# EAGLE design Access ID V2.0 (EAGLE 8.3.0)
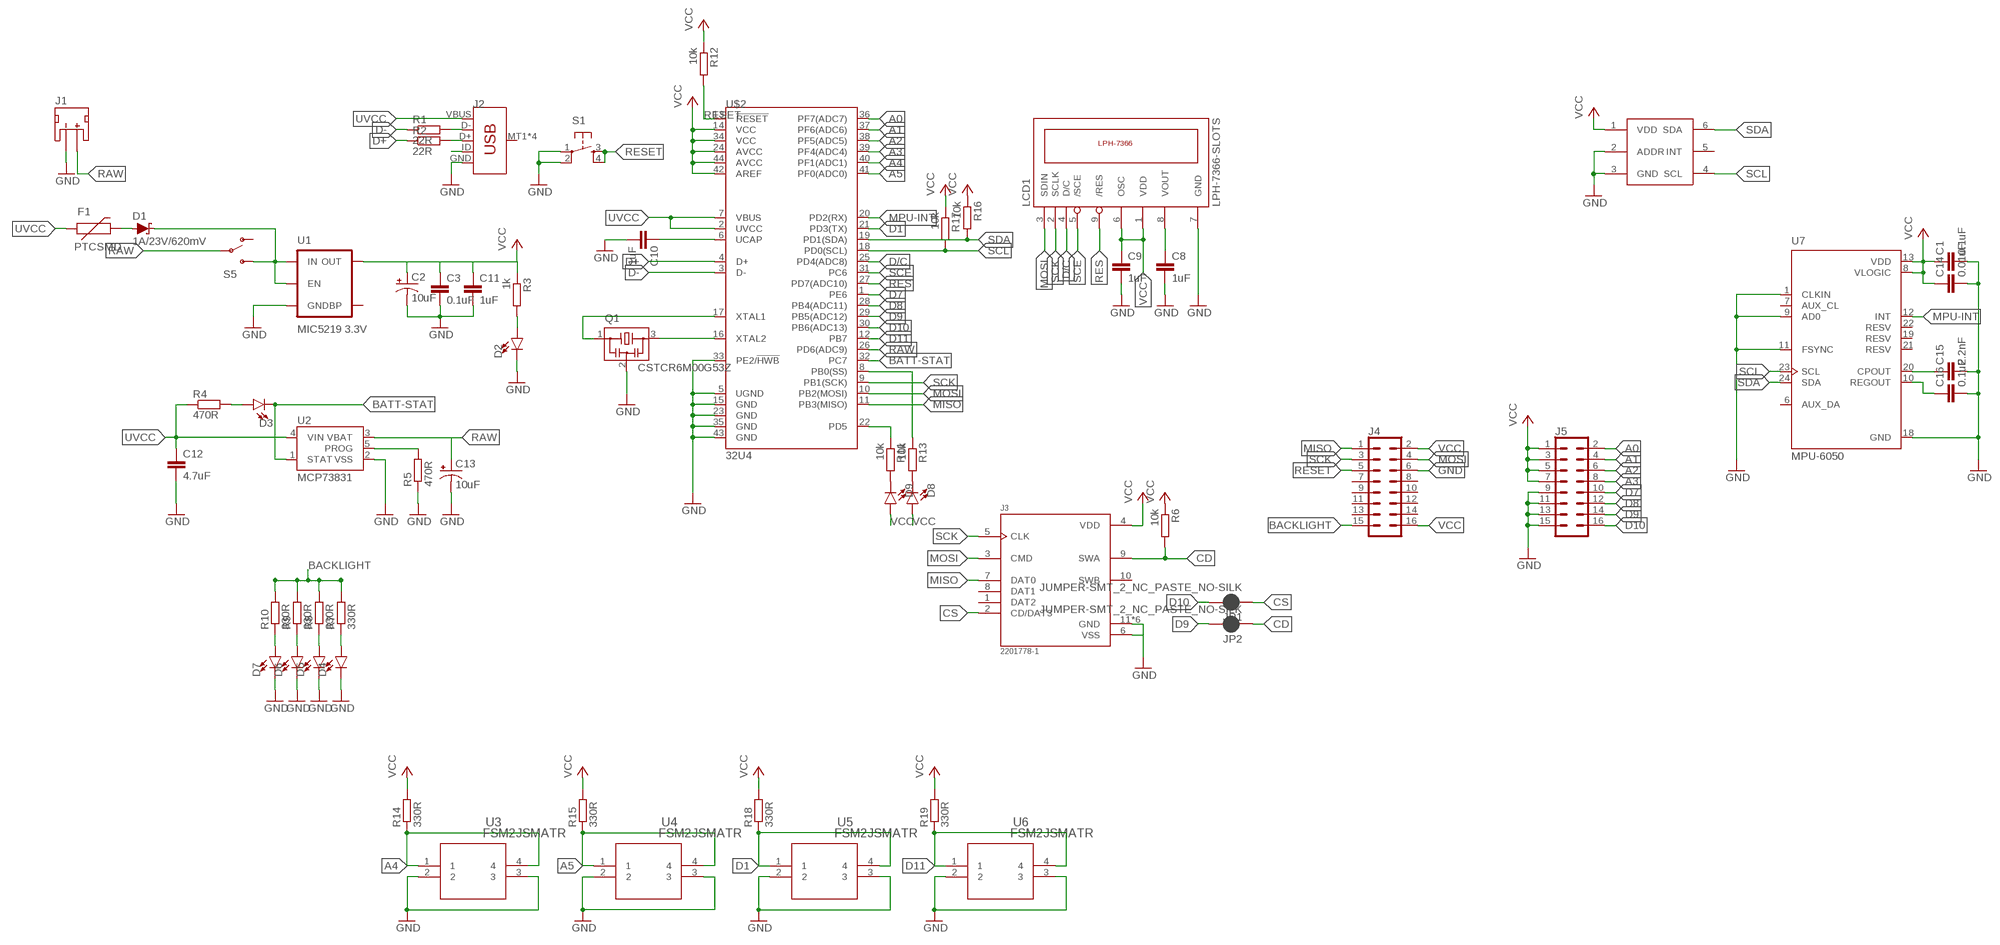
[diagram p0: schematic, sheet 1]

## Parts
C1  0.1uF  C-EUC0603K  [C0603K]
C2  10uF  10UF-POLAR-EIA3216-16V-10%(TANT)  [EIA3216]
C3  0.1uF  C-EUC0603K  [C0603K]
C8  1uF  C-EUC0603K  [C0603K]
C9  1uF  C-EUC0603K  [C0603K]
C10  1uF  C-EUC0603K  [C0603K]
C11  1uF  C-EUC0603K  [C0603K]
C12  4.7uF  C-EUC0603K  [C0603K]
C13  10uF  10UF-POLAR-EIA3216-16V-10%(TANT)  [EIA3216]
C14  0.01uF  C-EUC0603K  [C0603K]
C15  2.2nF  C-EUC0603K  [C0603K]
C16  0.1uF  C-EUC0603K  [C0603K]
D1  1A/23V/620mV  DIODE-SCHOTTKY-BAT20J  [SOD-323]
D2  LED0603  [LED-0603]
D3  LED0603  [LED-0603]
D4  LED0603  [LED-0603]
D5  LED0603  [LED-0603]
D6  LED0603  [LED-0603]
D7  LED0603  [LED-0603]
D8  LED0603  [LED-0603]
D9  LED0603  [LED-0603]
F1  PTCSMD  [PTC-1206]
J1  JST_2MM_MALE  [JST-2-SMD]
J2  USB_MICRO-B_SMT  [USB-MICROB]
J3  2201778-1  [TE_2201778-1]
J4  CONN_08X2  [2X8]
J5  CONN_08X2  [2X8]
JP1  JUMPER-SMT_2_NC_PASTE_NO-SILK  [SMT-JUMPER_2_NC_PASTE_NO-SILK]
JP2  JUMPER-SMT_2_NC_PASTE_NO-SILK  [SMT-JUMPER_2_NC_PASTE_NO-SILK]
LCD1  LPH-7366-SLOTS  [LPH-7366-SLOTS]
Q1  CSTCR6M00G53Z  [CSTCR6M]
R1  22R  R-EU_R0603  [R0603]
R2  22R  R-EU_R0603  [R0603]
R3  1k  R-EU_R0603  [R0603]
R4  470R  R-EU_R0603  [R0603]
R5  470R  R-EU_R0603  [R0603]
R6  10k  R-EU_R0603  [R0603]
R7  330R  R-EU_R0603  [R0603]
R8  330R  R-EU_R0603  [R0603]
R9  330R  R-EU_R0603  [R0603]
R10  330R  R-EU_R0603  [R0603]
R11  10k  R-EU_R0603  [R0603]
R12  10k  R-EU_R0603  [R0603]
R13  10k  R-EU_R0603  [R0603]
R14  330R  R-EU_R0603  [R0603]
R15  330R  R-EU_R0603  [R0603]
R16  10k  R-EU_R0603  [R0603]
R17  10k  R-EU_R0603  [R0603]
R18  330R  R-EU_R0603  [R0603]
R19  330R  R-EU_R0603  [R0603]
S1  TAC_SWITCHSMD  [TACTILE_SWITCH_SMD]
S5  SWITCH-SPDT-SMD-A  [SWITCH-SPST-SMD-A]
U1  MIC5219 3.3V  V_REG_MIC52193.3V  [SOT23-5]
U2  MCP73831  [SOT23-5]
U3  FSM2JSMATR  [SWITCH_FSM2JSMAA]
U4  FSM2JSMATR  [SWITCH_FSM2JSMAA]
U5  FSM2JSMATR  [SWITCH_FSM2JSMAA]
U6  FSM2JSMATR  [SWITCH_FSM2JSMAA]
U7  MPU-6050  [QFN50P400X400X95-24N]
U$2  32U4  ATMEGA32U4QFN2  [QFN-44-NOPAD]
U$3  TI-OPT3001  [TI-OPT3001]

## Nets
A0: J5.2 U$2.36(PF7(ADC7))
A1: J5.4 U$2.37(PF6(ADC6))
A2: J5.6 U$2.38(PF5(ADC5))
A3: J5.8 U$2.39(PF4(ADC4))
A4: R14.1 U3.1 U3.4 U$2.40(PF1(ADC1))
A5: R15.1 U4.1 U4.4 U$2.41(PF0(ADC0))
BACKLIGHT: J4.15 R7.2 R8.2 R9.2 R10.2
BATT-STAT: D3.C U2.1(STAT) U$2.32(PC7)
CD: J3.9(SWA) JP2.1 R6.2
CS: J3.2(CD/DAT3) JP1.1
D1: R18.1 U5.1 U5.4 U$2.21(PD3(TX))
D7: J5.10 U$2.1(PE6)
D8: J5.12 U$2.28(PB4(ADC11))
D9: J5.14 JP2.2 U$2.29(PB5(ADC12))
D10: J5.16 JP1.2 U$2.30(PB6(ADC13))
D11: R19.1 U6.1 U6.4 U$2.12(PB7)
D+: R2.1 U$2.4(D+)
D-: R1.1 U$2.3(D-)
D/C: LCD1.4(D/C) U$2.25(PD4(ADC8))
GND: C1.2 C2.- C3.2 C8.2 C9.2 C10.2 C11.2 C12.2 C13.- C14.2 C15.2 C16.2 D2.C D4.C D5.C D6.C D7.C J1.1(-) J2.GND J3.6(VSS) J3.11(GND) J3.12(GND) J3.13(GND) J3.14(GND) J3.15(GND) J3.16(GND) J4.6 J5.9 J5.11 J5.13 J5.15 LCD1.7(GND) Q1.2 R5.1 S1.1 S1.2 U1.2(GND) U2.2(VSS) U3.2 U3.3 U4.2 U4.3 U5.2 U5.3 U6.2 U6.3 U7.1(CLKIN) U7.9(AD0) U7.11(FSYNC) U7.18(GND) U$2.5(UGND) U$2.15(GND) U$2.23(GND) U$2.33(PE2/!HWB) U$2.35(GND) U$2.43(GND) U$3.2(ADDR) U$3.3(GND)
MISO: J3.7(DAT0) J4.1 U$2.11(PB3(MISO))
MOSI: J3.3(CMD) J4.4 LCD1.3(SDIN) U$2.10(PB2(MOSI))
MPU-INT: U7.12(INT) U$2.20(PD2(RX))
N$1: C15.1 U7.20(CPOUT)
N$2: D3.A R4.2
N$3: C10.1 U$2.6(UCAP)
N$5: J2.D+ R2.2
N$6: J2.ID
N$7: R5.2 U2.5(PROG)
N$8: D7.A R10.1
N$9: J2.D- R1.2
N$10: D6.A R9.1
N$11: C16.1 U7.10(REGOUT)
N$12: D1.C S5.3(S) U1.1(IN) U1.3(EN)
N$15: D2.A R3.2
N$16: D5.A R8.1
N$17: C8.1 LCD1.8(VOUT)
N$18: D4.A R7.1
N$19: Q1.1 U$2.17(XTAL1)
N$20: D1.A F1.2
N$21: Q1.3 U$2.16(XTAL2)
N$22: R13.1 U$2.8(PB0(SS))
N$23: D9.C R11.2
N$25: R11.1 U$2.22(PD5)
N$26: D8.C R13.2
RAW: C13.+ J1.2(+) S5.2(P) U2.3(VBAT) U$2.26(PD6(ADC9))
RES: LCD1.9(/RES) U$2.27(PD7(ADC10))
RESET: J4.5 R12.2 S1.3 S1.4 U$2.13(!RESET)
SCE: LCD1.5(/SCE) U$2.31(PC6)
SCK: J3.5(CLK) J4.3 LCD1.2(SCLK) U$2.9(PB1(SCK))
SCL: R17.2 U7.23(SCL) U$2.18(PD0(SCL)) U$3.4(SCL)
SDA: R16.2 U7.24(SDA) U$2.19(PD1(SDA)) U$3.6(SDA)
UVCC: C12.1 F1.1 J2.VBUS R4.1 U2.4(VIN) U$2.2(UVCC) U$2.7(VBUS)
VCC: C1.1 C2.+ C3.1 C9.1 C11.1 C14.1 D8.A D9.A J3.4(VDD) J4.2 J4.16 J5.1 J5.3 J5.5 J5.7 LCD1.1(VDD) LCD1.6(OSC) R3.1 R6.1 R12.1 R14.2 R15.2 R16.1 R17.1 R18.2 R19.2 U1.5(OUT) U7.8(VLOGIC) U7.13(VDD) U$2.14(VCC) U$2.24(AVCC) U$2.34(VCC) U$2.42(AREF) U$2.44(AVCC) U$3.1(VDD)
Unconnected: J1.NC1(PAD1) J1.NC2(PAD2) J2.MT1(SHIELD) J2.MT2(SHIELD) J2.P$1(SHIELD) J2.P$2(SHIELD) J3.1(DAT2) J3.8(DAT1) J3.10(SWB) J4.7 J4.8 J4.9 J4.10 J4.11 J4.12 J4.13 J4.14 S5.1(O) U1.4(BP) U7.6(AUX_DA) U7.7(AUX_CL) U7.19(RESV) U7.21(RESV) U7.22(RESV) U$3.5(INT)

## Library data of the parts
C1 C3 C8-C12 C14-C16 = resistor:C-EU: CAPACITOR, European symbol
C2 C13 = SparkFun-Capacitors:10UF-POLAR: 10.0µF polarized capacitors A capacitor is a passive two-terminal electrical component used to store electrical energy temporarily in an electric field.; PROD_ID: CAP-00811
D1 = SparkFun-DiscreteSemi:DIODE-SCHOTTKY: Schottky diode A Schottky diode is a semiconductor diode which has a low forward voltage drop and a very fast switching action.; PROD_ID: DIO-11623
D2-D9 = SparkFun-LED:LED: LED (Generic) Standard schematic elements and footprints for 5mm, 3mm, 1206, and 0603 sized LEDs. Generic LEDs with no color specified.
F1 = SparkFun-PowerIC:PTC: Resettable Fuse PTC Resettable Fuse. Spark Fun Electronics SKU : COM-08357; PROD_ID: RES-11150
J1 = SparkFun-Connectors:JST_2MM_MALE: Mates to single-cell LiPo batteries. CONN-11443 Now with smashable polarity marks!; BTM_NEG: -; BTM_POS: +; PROD_ID: CONN-11443; TOP_NEG: -; TOP_POS: +
J2 = SparkFun-Connectors:USB_MICRO-B: USB Type Micro-B Connector Male/female and PTH/SMT variants SparkFun Products: SparkFun microB USB Breakout <https://www.sparkfun.com/products/12035> SparkFun USB microB Plug Breakout <https://www.sparkfun.com/products/10031> SparkFun ESP8266 Thing <https://www.sparkfun.com/products/13231>; PROD_ID: CONN-09505; SF_ID: PRT-08533
J3 = 2201778-1:2201778-1: MICRO SD PUSH PUSH LOW PROFILE TYPE; MANUFACTURER: TE Connectivity; PARTREV: B; STANDARD: Manufacturer recommendations
J4 J5 = SparkFun-Connectors:CONN_08X2: Multi connection point. Often used as Generic Header-pin footprint for 0.1 inch spaced/style header connections You can populate with any combo of single row headers, but if you'd like an exact match, check this: Header - 2x8 (Male, 0.1") <https://www.sparkfun.com/products/13156> (PRT-13156) On any of the 0.1 inch spaced packages, you can populate with these: Break Away Headers - Straight <https://www.sparkfun.com/products/116> (PRT-00116) Break Away Male Headers - Right Angle <https://www.sparkfun.com/products/553> (PRT-00553) Female Headers <https://www.sparkfun.com/products/115> (PRT-00115) Break Away Headers - Machine Pin <https://www.sparkfun.com/products/117> (PRT-00117) Break Away Female Headers - Swiss Machine Pin <https://www.sparkfun.com/products/743> (PRT-00743)
JP1 JP2 = SparkFun-Jumpers:JUMPER-SMT_2_NC_PASTE: Normally closed solder jumper This jumper has an aperture in the stencil to allow solder paste to bridge the split in the wire so it's normally closed (NC). Wick off the solder to open the connection. Reapply solder to reclose the connection.
LCD1 = lph-7366 copy:LPH-7366-SLOTS
Q1 = murata-filter:CSTCR: Resonator Source: murata.co.jp; MPN: CSTCR6M00G53-R0; OC_FARNELL: 1170434; OC_NEWARK: 25M8759
R1-R19 = resistor:R-EU_: RESISTOR, European symbol
S1 = adjacent-reality:TAC_SWITCH: Momentary Switch Button commonly used for reset or general input. Spark Fun Electronics SKU : COM-00097
S5 = SparkFun-Electromechanical:SWITCH-SPDT: SPDT Switch Simple slide switch, Spark Fun Electronics SKU : COM-00102 DPDT SMT slide switch, AYZ0202, SWCH-08179; PROD_ID: SWCH-10651
U1 = SparkFun-PowerIC:V_REG_MIC5219: V_REG MIC5219 Standard 3.3V and 5V 500mA LDO voltage regulator in SOT-23 layout. Micrel part MIC5219. BP (by-pass) pin is used to lower output noise with 470pF cap, may be left open.; PROD_ID: VREG-09872
U2 = SparkFun-PowerIC:MCP73831: Miniature single cell, fully integrated Li-Ion, Li-polymer charge management controller http://ww1.microchip.com/downloads/en/DeviceDoc/20001984g.pdf IC-09995; PROD_ID: IC-09995
U3-U6 = Beeclust:FSM2JSMATR; MANUFACTURER_PART_NUMBER: FSM2JSMATR; VENDOR: TE Connectivity
U7 = MPU-6050:MPU-6050: MPU-6050 Six-Axis (Gyro + Accelerometer) MEMS MotionTracking™ Devices; AVAILABILITY: Good; DESCRIPTION: 3-axis gyroscope, 3-axis accelerometer in a 4x4x0.9 housing; MF: TDK; MP: MPU-6050; PACKAGE: QFN-24 InvenSense; PRICE: 5.41 USD
U$2 = SparkFun-IC-Microcontroller:ATMEGA32U4: Atmel MCU, 32KByte Atmel 44-pin 8-bit Microcontroller with 32KBytes of ISP Flash and USB Controller Datasheet <http://cdn.sparkfun.com/datasheets/Dev/Arduino/Boards/ATMega32U4.pdf> SparkFun Products LilyPad Arduino USB - ATmega32U4 Board <https://www.sparkfun.com/products/12049> (DEV-12049) Pro Micro - 5V/16MHz <https://www.sparkfun.com/products/12640> (DEV-12640) Pro Micro - 3.3V/8MHz <https://www.sparkfun.com/products/12587> (DEV-12587) Fio v3 - ATmega32U4 <https://www.sparkfun.com/products/11520> (DEV-11520) Qduino Mini <https://www.sparkfun.com/products/13614> (DEV-13614) Makey Makey - Standard Kit <https://www.sparkfun.com/products/11511> (WIG-11511) Makey Makey Deluxe Kit <https://www.sparkfun.com/products/11519> (WIG-11519); PROD_ID: IC-10828
U$3 = FaBo-Mems:TI-OPT3001

## Board
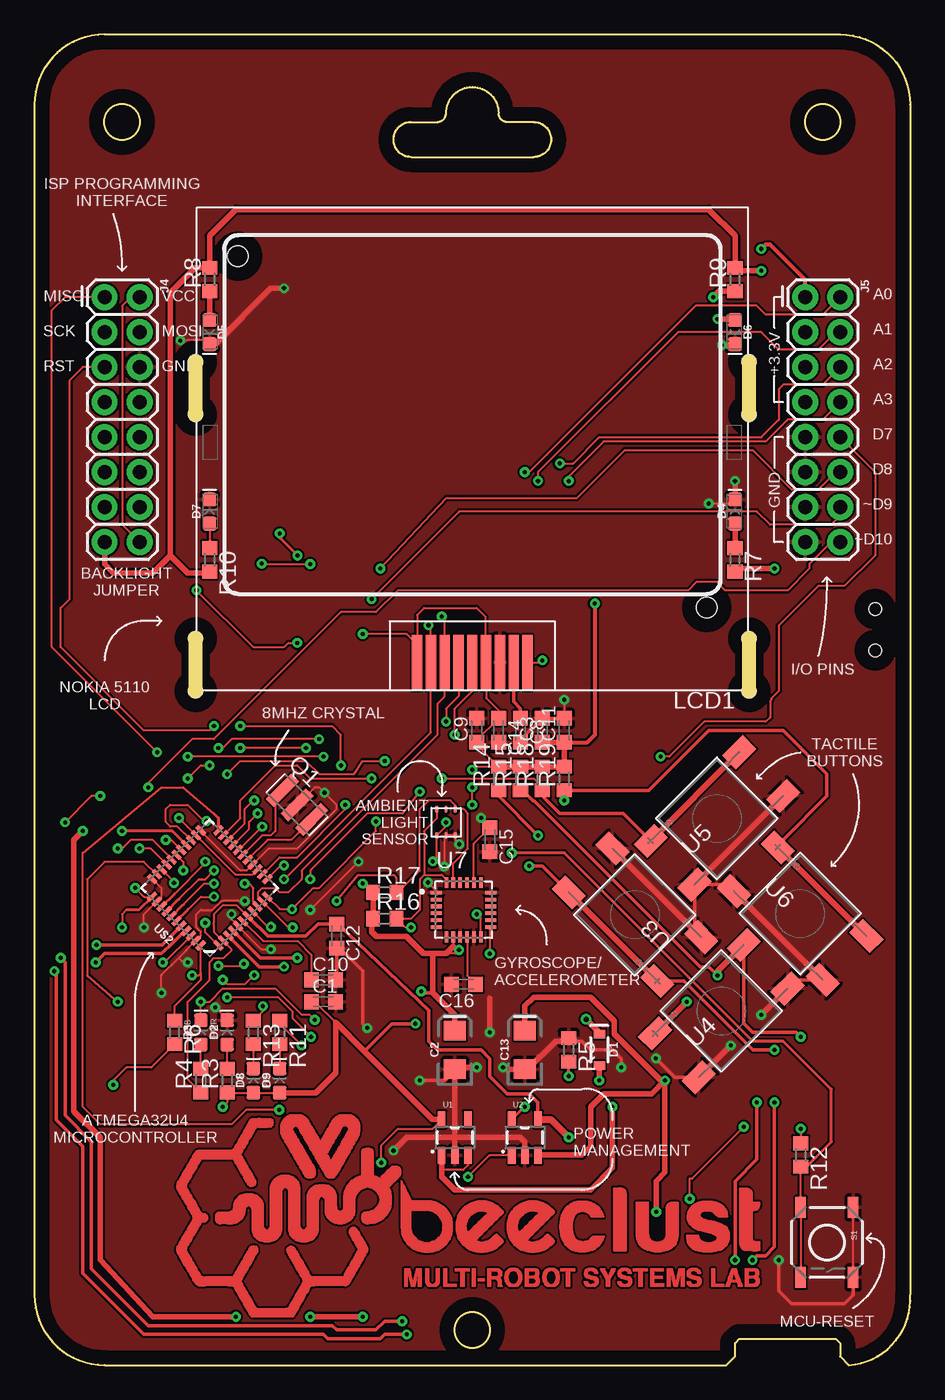
[diagram p1: board, top side]
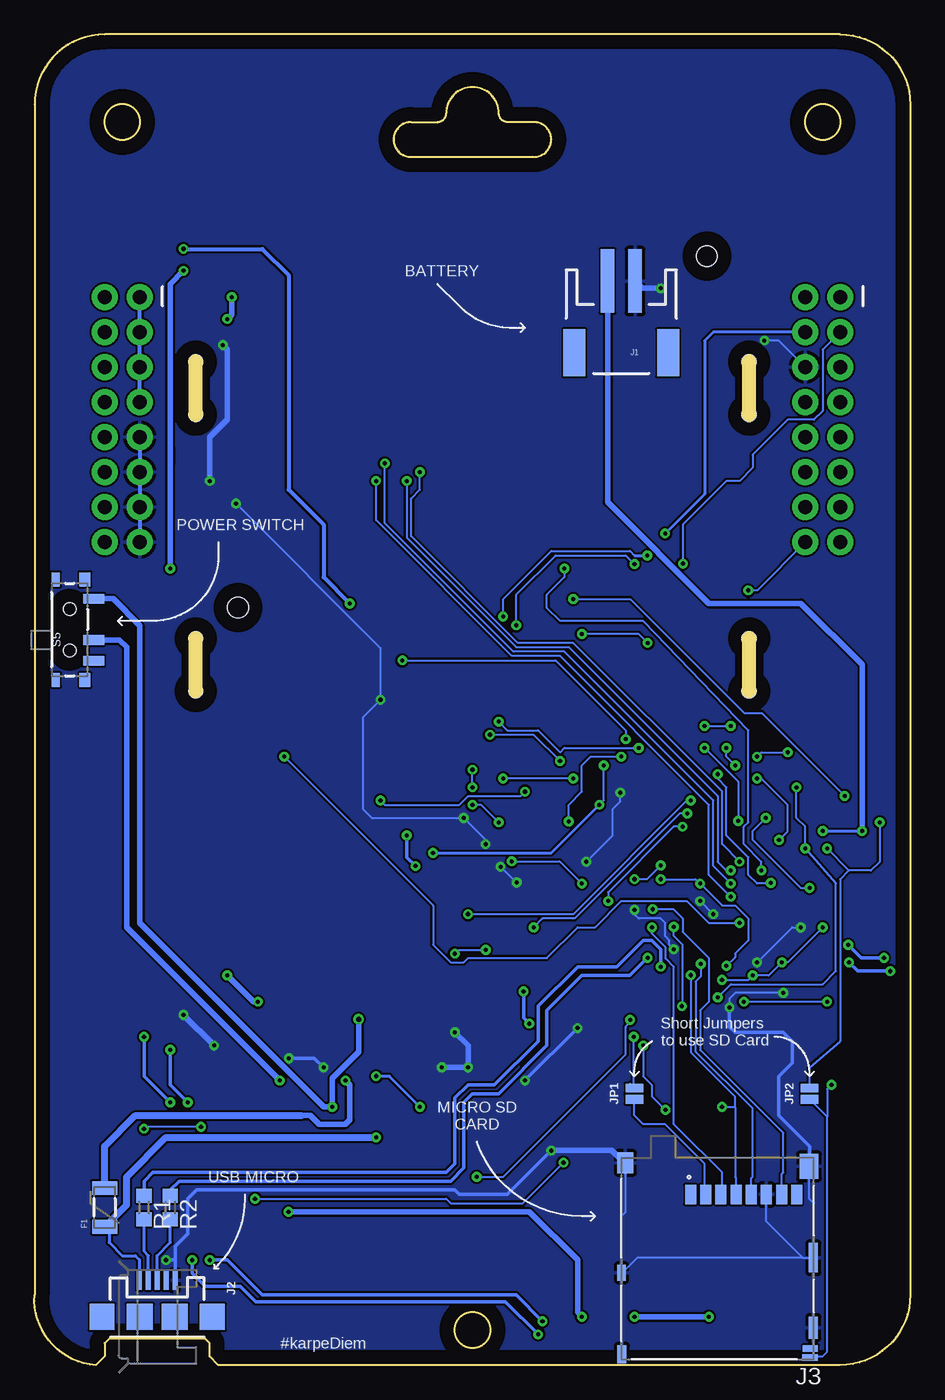
[diagram p2: board, bottom side, seen from below]

Size 63.51 x 96.52 mm. Coordinates in mm from the lower left corner, seen from the top.
Outline: 5.08,96.52 58.42,96.52 arc-90 63.5,91.44 63.5,5.08 arc-90 59.05,0 58.42,0.63 58.42,1.59 58.1,1.91 51.12,1.91 50.8,1.59 50.8,0.63 50.16,0 5.08,0 arc-90 0,5.08 0,91.44 arc-90 5.08,96.52
Outline: 26.04,88.9 arc-90 27.3,90.17 29.21,90.17 arc90 29.84,90.8 arc-180 33.66,90.8 arc90 34.29,90.17 36.2,90.17 arc-90 37.47,88.9 arc-90 36.2,87.63 27.3,87.63 arc-90 26.04,88.9
Outline: circle at 6.35,90.17 radius 1.27
Outline: circle at 57.15,90.17 radius 1.27
Outline: circle at 31.75,2.54 radius 1.27
Copper layers (1*16): Top 0.035mm / dielectric 1.5mm / Bottom 0.035mm
Design rules "default *": minimum track width 6mil, minimum drill 0.35mm, track to track 6mil, track to pad 6mil, pad to pad 6mil, via to via 6mil, smd to smd 6mil, copper to edge 40mil, drill to drill 6mil, minimum pad ring 10mil, minimum via ring 8mil, stop-mask expansion 4mil, vias tented up to drill 12mil, thermal gap 10mil

### Footprints (pad centres in the part's own frame; a part is rotated, then mirrored left to right if it is on the bottom)
C0603K = smd 1.05 x 1.08: 1 -0.875,0; 2 0.875,0
EIA3216 = smd 1.4 x 1.6: + 1.4,0; - -1.4,0
SOD-323 = smd 0.63 x 0.83: A 1.15,0; C -1.15,0
LED-0603 = smd 1 x 1: A -0.877,0; C 0.877,0
PTC-1206 = smd 1 x 1.8: 1 -1.4,0; 2 1.4,0
JST-2-SMD = smd 1 x 4.6: 1 -1,-3.7; 2 1,-3.7 | smd 1.6 x 3.4: NC1 -3.4,1.5; NC2 3.4,1.5
USB-MICROB = smd 1.4 x 0.35: D+ -2.65,0; D- -2.65,-0.65; GND -2.65,1.3; ID -2.65,0.65; VBUS -2.65,-1.3 | smd 1.9 x 1.8: MT1 0,-4; MT2 0,4 | smd 1.9 x 1.9: P$1 0,-1.27; P$2 0,1.27
TE_2201778-1 = smd 0.8 x 1.4: 1 1.965,-4.75; 2 0.865,-4.75; 3 -0.235,-4.75; 4 -1.335,-4.75; 5 -2.435,-4.75; 6 -3.535,-4.75; 7 -4.635,-4.75; 8 -5.735,-4.75 | smd 1.15 x 0.45: 9 -6.7,7.075 | smd 1.1 x 0.45: 10 -6.725,6.415 | smd 1.35 x 1.8: 11 -6.625,-6.8 | smd 0.65 x 2.14: 12 -6.95,-0.17 | smd 0.65 x 1.6: 13 -6.95,4.91 | smd 0.65 x 1.3: 14 6.95,6.85 | smd 0.6 x 1.15: 15 6.975,0.925 | smd 1.16 x 1.5: 16 6.695,-7.05
2X8 = drill 1.016 pad 1.88: 1 0,0; 2 0,2.54; 3 2.54,0; 4 2.54,2.54; 5 5.08,0; 6 5.08,2.54; 7 7.62,0; 8 7.62,2.54; 9 10.16,0; 10 10.16,2.54; 11 12.7,0; 12 12.7,2.54; 13 15.24,0; 14 15.24,2.54; 15 17.78,0; 16 17.78,2.54
SMT-JUMPER_2_NC_PASTE_NO-SILK = smd 0.635 x 1.27: 1 -0.406,0; 2 0.406,0
LPH-7366-SLOTS = smd 0.75 x 4: 1 4,17; 2 3,17; 3 2,17; 4 1,17; 5 0,17; 6 -1,17; 7 -2,17; 8 -3,17; 9 -4,17 | hole 1.5: -17,13; 17,-12.5 | hole 1.016: -20.066,19.05; -20.066,15.24; 20.066,19.05; 20.066,15.24; 20.066,-1.016; 20.066,-4.826; -20.066,-1.016; -20.066,-4.826
CSTCR6M = smd 0.8 x 2.6: 1 -1.5,0; 2 0,0; 3 1.5,0
R0603 = smd 1 x 1.1: 1 -0.85,0; 2 0.85,0
TACTILE_SWITCH_SMD = smd 1.524 x 0.762: 1 -2.54,1.905; 2 2.54,1.905; 3 -2.54,-1.905; 4 2.54,-1.905
SWITCH-SPST-SMD-A = smd 0.7 x 1.5: 1 -2.25,-1.75; 2 -0.75,-1.75; 3 2.25,-1.75 | smd 1 x 0.6: GND1 -3.65,1; GND3 3.65,1 | smd 1 x 0.8: GND2 -3.65,-1.1; GND4 3.65,-1.1 | hole 0.9: -1.5,0; 1.5,0
SOT23-5 = smd 0.55 x 1.2: 1 -0.95,-1.3; 2 0,-1.3; 3 0.95,-1.3; 4 0.95,1.3; 5 -0.95,1.3
SWITCH_FSM2JSMAA = smd 2.108 x 1.397: 1 -9.093,4.496; 2 -9.093,0; 3 0,0; 4 0,4.496
QFN50P400X400X95-24N = smd 0.79 x 0.26: 1 -1.97,1.25; 2 -1.97,0.75; 3 -1.97,0.25; 4 -1.97,-0.25; 5 -1.97,-0.75; 6 -1.97,-1.25; 13 1.97,-1.25; 14 1.97,-0.75; 15 1.97,-0.25; 16 1.97,0.25; 17 1.97,0.75; 18 1.97,1.25 | smd 0.26 x 0.79: 7 -1.25,-1.97; 8 -0.75,-1.97; 9 -0.25,-1.97; 10 0.25,-1.97; 11 0.75,-1.97; 12 1.25,-1.97; 19 1.25,1.97; 20 0.75,1.97; 21 0.25,1.97; 22 -0.25,1.97; 23 -0.75,1.97; 24 -1.25,1.97
QFN-44-NOPAD = smd 0.8 x 0.3: 1 -3.4,2.5; 2 -3.4,2; 3 -3.4,1.5; 4 -3.4,1; 5 -3.4,0.5; 6 -3.4,0; 7 -3.4,-0.5; 8 -3.4,-1; 9 -3.4,-1.5; 10 -3.4,-2; 11 -3.4,-2.5; 23 3.4,-2.5; 24 3.4,-2; 25 3.4,-1.5; 26 3.4,-1; 27 3.4,-0.5; 28 3.4,0; 29 3.4,0.5; 30 3.4,1; 31 3.4,1.5; 32 3.4,2; 33 3.4,2.5 | smd 0.3 x 0.8: 12 -2.5,-3.4; 13 -2,-3.4; 14 -1.5,-3.4; 15 -1,-3.4; 16 -0.5,-3.4; 17 0,-3.4; 18 0.5,-3.4; 19 1,-3.4; 20 1.5,-3.4; 21 2,-3.4; 22 2.5,-3.4; 34 2.5,3.4; 35 2,3.4; 36 1.5,3.4; 37 1,3.4; 38 0.5,3.4; 39 0,3.4; 40 -0.5,3.4; 41 -1,3.4; 42 -1.5,3.4; 43 -2,3.4; 44 -2.5,3.4
TI-OPT3001 = smd 0.5 x 0.25: 1 -0.95,0.675; 2 -0.95,0; 3 -0.95,-0.675; 4 0.95,-0.675; 5 0.95,0; 6 0.95,0.675

### Placement (x,y rotation side)
C1  20.95,26.35 0 top
C2  30.48,22.86 90 top
C3  36.83,46.04 90 top
C8  35.24,46.04 270 top
C9  32.07,46.04 90 top
C10  20.95,27.94 0 top
C11  38.42,46.04 90 top
C12  21.91,31.12 270 top
C13  35.56,22.86 90 top
C14  33.66,46.04 270 top
C15  33.02,38.1 270 top
C16  31.11,27.62 180 top
D1  40.96,22.86 270 top
D2  13.97,24.13 90 top
D3  12.06,24.13 90 top
D4  50.8,61.91 90 top
D5  12.7,74.93 270 top
D6  50.8,74.93 270 top
D7  12.7,61.91 90 top
D8  15.88,20.64 90 top
D9  17.78,20.64 90 top
F1  58.42,11.43 90 bottom
J1  20.95,74.93 180 bottom
J2  54.61,3.49 270 bottom
J3  13.97,7.62 180 bottom
J4  5.08,77.47 270 top
J5  55.88,77.47 270 top
JP1  20,19.69 90 bottom
JP2  7.3,19.69 90 bottom
LCD1  31.75,67.94 180 top
Q1  19.05,40.64 315 top
R1  55.56,11.43 270 bottom
R2  53.66,11.43 270 bottom
R3  13.97,20.64 90 top
R4  12.06,20.64 90 top
R5  38.73,22.86 270 top
R6  10.16,24.13 270 top
R7  50.8,58.42 270 top
R8  12.7,78.74 90 top
R9  50.8,78.74 90 top
R10  12.7,58.42 270 top
R11  17.78,24.13 270 top
R12  55.56,15.24 270 top
R13  15.88,24.13 270 top
R14  33.66,42.55 90 top
R15  35.24,42.55 90 top
R16  25.4,32.38 0 top
R17  25.4,34.29 0 top
R18  36.83,42.55 90 top
R19  38.42,42.55 90 top
S1  57.47,8.89 270 top
S5  60.96,53.34 90 bottom
U1  30.48,16.51 0 top
U2  35.56,16.51 0 top
U3  41.91,37.47 135 top
U4  54.61,27.3 45 top
U5  54.29,41.27 45 top
U6  57.15,27.94 315 top
U7  31.11,33.02 0 top
U$2  12.7,34.61 135 top
U$3  29.84,39.37 90 top

### Tracks (layer width: path | path; a pad name or v marks a point on that pad's centre or on a via)
A0  (via drill 0.3)
  Top 0.152: J5.2 57.15,76.2 53.02,76.2 52.39,76.83 47.94,76.83 37.24,66.14 | 37.24,66.14 37.15,66.04 | 10.16,34.19 12.38,36.41 v12.38,36.51 | v35.56,64.77 35.88,64.77 37.24,66.14
  Top 0.203: U$2.36 10.16,34.19
  Bottom 0.152: v12.38,36.51 13.65,37.78 13.65,41.59 24.45,52.39 28.46,52.39 36.2,60.12 36.2,62.87 35.56,63.5 v35.56,64.77
A1  (via drill 0.3)
  Top 0.152: J5.4 58.1,74.93 56.83,73.66 53.98,73.66 52.7,74.93 46.67,74.93 36.51,64.77 v36.51,64.13 | v13.02,35.88 12.38,35.24 12.16,35.24 | 12.16,35.24 12.06,35.24 | 10.48,33.8 11.92,35.24 12.16,35.24
  Top 0.203: U$2.37 10.48,33.8
  Bottom 0.152: v36.51,64.13 36.51,60.01 28.57,52.07 24.77,52.07 13.97,41.27 13.97,36.51 13.34,35.88 v13.02,35.88
A2  (via drill 0.3)
  Top 0.152: J5.6 57.15,71.12 54.29,71.12 53.98,70.8 53.98,68.58 52.7,67.31 40.96,67.31 39.05,65.4 v38.1,65.4 | 10.79,33.41 12.31,34.93 v13.02,34.93
  Top 0.203: U$2.38 10.79,33.41
  Bottom 0.152: v13.02,34.93 14.29,36.2 14.29,40.96 25.08,51.75 28.78,51.75 38.1,61.07 v38.1,65.4
A3  (via drill 0.3)
  Top 0.152: J5.8 57.15,68.58 54.61,68.58 53.02,66.99 41.27,66.99 38.73,64.45 v38.73,64.13 | 11.15,33.06 12.06,33.97 v13.02,33.97
  Top 0.203: U$2.39 11.15,33.06
  Bottom 0.152: v13.02,33.97 14.61,35.56 14.61,40.64 25.4,51.44 28.89,51.44 38.73,61.28 v38.73,64.13
A4  (via drill 0.3)
  Top 0.254: R14.1 33.66,41.27 v36.51,38.42 | v35.88,36.2 36.82,36.2 U3.4 | U3.1 47.07,27.86 52.07,22.86 v53.66,22.86 | v52.39,19.05 52.39,14.92 50.8,13.34 v50.8,7.62 | v26.67,3.17 25.4,3.17 24.77,2.54 21.91,2.54 21.59,2.86 8.26,2.86 4.13,6.99 4.13,16.19 2.22,18.1 2.22,29.21 v1.91,29.53 | v4.5,30.48 9.28,30.48 U$2.40
  Top 0.406: U3.4 U3.1
  Bottom 0.254: v36.51,38.42 36.51,36.83 v35.88,36.2 | v53.66,22.86 53.66,20.32 v52.39,19.05 | v50.8,7.62 49.53,7.62 46.99,5.08 28.57,5.08 v26.67,3.17 | v1.91,29.53 3.55,29.53 v4.5,30.48
A5  (via drill 0.3)
  Top 0.254: R15.1 35.38,41.7 36.16,40.92 36.24,40.92 48.26,28.89 48.9,28.89 v49.53,28.26 | U4.4 51.43,24.77 52.07,24.13 55.24,24.13 v55.56,23.81 | v53.66,19.05 53.66,8.57 53.02,7.94 52.39,7.94 v52.07,7.62 | v26.99,2.22 25.4,2.22 25.08,1.91 21.27,1.91 20.95,2.22 7.94,2.22 3.49,6.67 3.49,15.88 1.59,17.78 1.59,28.43 v1.45,28.57 | U$2.41 10.9,31.5 9.72,30.31 9.69,30.31 9.53,30.16 | 9.53,30.16 | 9.53,30.16 9.45,30.07 9.44,30.07 9.21,29.84 5.08,29.84 v4.45,29.21
  Top 0.406: U4.1 v47.31,26.35 | v49.53,28.26 49.53,28.58 U4.4
  Bottom 0.254: v55.56,23.81 55.56,20.96 v53.66,19.05 | v52.07,7.62 52.07,6.67 51.12,5.72 48.58,5.72 47.47,4.6 29.37,4.6 v26.99,2.22 | v4.45,29.21 3.81,28.57 v1.45,28.57
  Bottom 0.406: v47.31,26.35 47.62,26.35 v49.53,28.26
BACKLIGHT  (via drill 0.3)
  Top 0.406: 9.84,58.74 9.84,77.79 11.64,79.59 R8.2 12.7,81.91 14.61,83.82 48.9,83.82 50.8,81.91 R9.2 51.02,79.38 v52.7,79.38 | 9.84,58.74 11.11,57.47 12.6,57.47 R10.2 | 9.84,58.74 8.57,57.47 5.71,57.47 5.08,58.1 J4.15 | R7.2 51.02,57.79 v53.66,57.79
  Bottom 0.406: v52.7,79.38 53.66,78.42 53.66,66.5 | 53.66,66.5 53.66,65.4 | v53.66,57.79 53.66,66.5
BATT-STAT  (via drill 0.3)
  Top 0.152: U2.1 32.99,15.21 v31.43,13.65 | U$2.32 8.85,35.6 7.94,36.51 5.08,36.51 3.81,35.24 3.81,28.26 v6.03,26.35 | D3.C v12.06,26.35 12.7,26.35 13.65,27.3 17.46,27.3 19.37,25.4 19.95,25.4 v20.32,25.03
  Bottom 0.152: v31.43,13.65 29.53,13.65 20.64,22.54 20.64,24.45 20.62,24.46 20.62,24.57 20.32,24.88 v20.32,25.03 | v6.03,26.35 v12.06,26.35
CD  (via drill 0.3)
  Top 0.152: R6.2 8.47,21.59 6.67,21.59 5.71,20.64 v5.71,20.32
  Bottom 0.152: 6.03,18.01 JP2.1 | 6.03,18.01 6.03,0.95 6.35,0.63 7.18,0.63 J3.9 | v5.71,20.32 6.03,20 6.03,18.01
CS
  Bottom 0.152: J3.2 14.92,12.46 14.92,14.61 17.78,17.46 19.37,17.46 20,18.1 JP1.1
D1  (via drill 0.3)
  Top 0.152: U$2.21 14.92,39.66 14.92,40.96 17.46,43.5 19.05,43.5 20,42.55 v24.45,42.55 | v29.53,42.55 36.2,42.55 36.83,41.91 R18.1
  Top 0.254: R18.1 36.83,41.27 38.1,40.01 42.7,40.01 U5.1
  Top 0.406: U5.1 U5.4
  Bottom 0.152: v24.45,42.55 v29.53,42.55
D7  (via drill 0.3)
  Top 0.152: J5.10 60.96,64.77 60.96,64.13 60.96,58.74 58.74,56.52 56.83,56.52 53.98,53.66 53.98,48.9 53.42,48.34 53.42,48.23 53.34,48.16 53.34,46.99 53.02,46.67 48.58,46.67 46.04,44.13 v45.4,44.13 | U$2.1 12.38,31.39 v12.38,32.07
  Bottom 0.152: v45.4,44.13 34.61,33.34 34.61,30.48 33.34,29.21 32.38,29.21 32.07,29.53 26.35,29.53 24.13,31.75 22.86,31.75 20.95,33.66 16.19,33.66 14.61,32.07 v12.38,32.07
D8  (via drill 0.3)
  Top 0.152: J5.12 58.1,64.77 56.83,63.5 54.93,63.5 52.07,66.36 42.79,66.36 39.31,62.88 29.86,62.88 v25.08,57.79 | U$2.28 | v10.79,35.88 10.79,36.51 U$2.28
  Bottom 0.152: v25.08,57.79 25.08,57.15 26.35,55.88 26.35,54.93 25.4,53.98 19.37,53.98 11.75,46.04 11.75,39.37 12.06,39.05 12.06,37.78 10.79,36.51 v10.79,35.88
D9  (via drill 0.3)
  Top 0.152: J5.14 58.42,61.6 57.78,60.96 53.34,60.96 52.39,61.91 30.8,61.91 v24.45,55.56 | v6.03,37.47 6.35,37.47 6.99,38.1 8.57,38.1 9.94,36.73 U$2.29 | v4.76,41.27 4.13,41.27 v2.22,39.37
  Bottom 0.152: JP2.2 7.3,21.59 5.08,23.5 5.08,35.24 4.45,35.87 4.45,35.88 | v4.76,41.27 10.78,47.3 12.03,47.3 20.3,55.56 v24.45,55.56 | v2.22,39.37 2.22,36.51 2.86,35.88 4.45,35.88 | 4.45,35.88 4.45,35.89 v6.03,37.47
D10  (via drill 0.3)
  Top 0.152: J5.16 57.78,59.69 56.2,58.1 56.2,57.79 54.61,56.2 50.1,56.2 49.51,56.79 47.99,56.79 47.4,56.2 26.35,56.2 24.77,54.61 22.23,54.61 13.02,45.4 11.43,45.4 8.26,42.23 v8.26,41.91 | v20.06,23.81 18.73,25.14 18.73,25.6 17.67,26.67 v13.97,26.67 | U$2.30 8.43,37.47 v7.62,37.47
  Bottom 0.152: 20.32,20.41 JP1.2 20.06,20.14 v20.06,23.81 | v13.97,26.67 13.02,27.62 6.35,27.62 5.4,28.57 5.4,34.93 v7.62,37.47 7.62,39.05 8.26,39.69 v8.26,41.91
D11  (via drill 0.3)
  Top 0.152: U$2.12 17.88,36.25 v18.1,36.25 | R19.1 v38.42,40.96 | v27.94,41.59 26.67,40.01 24.13,40.01 20,35.88 v20,35.24
  Top 0.254: R19.1 44.55,41.7 48.9,46.04 54.29,46.04 57.47,42.86 57.47,41.27 54.29,38.1 54.29,37.94 U6.1
  Top 0.406: U6.1 U6.4
  Bottom 0.152: v18.1,36.25 19.1,35.24 v20,35.24 | v38.42,40.96 38.1,40.64 32.7,40.64 32.07,41.27 28.26,41.27 v27.94,41.59
D+  (via drill 0.3)
  Top 0.254: U$2.4 16.37,29.53 v19.05,29.53
  Bottom 0.254: R2.1 53.66,12.7 53.02,13.34 33.34,13.34 32.38,14.29 32.38,19.05 31.75,19.69 29.84,19.69 26.35,23.18 26.35,25.72 23.81,28.26 20.34,28.26 19.07,29.53 v19.05,29.53
D-  (via drill 0.3)
  Top 0.254: U$2.3 16.29,28.89 v18.1,28.89
  Bottom 0.254: v18.1,28.89 18.1,30.16 18.73,30.8 19.37,30.8 21.27,28.89 24.13,28.89 26.99,26.04 26.99,23.5 30.16,20.32 32.07,20.32 33.02,19.37 33.02,14.61 33.66,13.97 54.93,13.97 55.56,13.34 R1.1
D/C  (via drill 0.3)
  Top 0.152: LCD1.4 30.75,48.53 29.84,47.62 v29.84,46.67 | v19.68,44.77 v14.92,44.77 | 9.85,39.06 | 9.85,39.06 9.84,39.06 9.53,39.38 9.53,40.32 9.84,40.64 11.11,40.64 12.29,39.46 v12.48,39.46 | U$2.25 10.36,39.06 9.85,39.06
  Bottom 0.152: v29.84,46.67 29.21,46.04 26.99,46.04 25.4,44.45 25.08,44.77 v19.68,44.77 | v14.92,44.77 12.48,42.32 v12.48,39.46
GND  (via drill 0.3)
  Top 0.152: S1.1 59.37,6.4 59.37,5.72 | U$2.23 12.06,38.74 14.92,35.88 15.38,35.88 U$2.15 16.97,37.47 19.05,37.47 21.91,40.32 21.91,40.64 v21.03,41.52 20.64,41.91 20.32,41.91 Q1.2 | D2.C 13.97,25.08 v13.11,25.94 | v9.21,26.99 9.21,28.29 10.46,29.54 | 10.46,29.54 U$2.43 12.06,31.14 12.06,31.43 11.75,31.75 11.75,32.7 12.06,33.02 12.9,33.02 13.53,33.64 13.64,33.64 13.65,33.66 v15.24,33.66 | U$3.2 29.71,38.28 v29.71,36.14 | v28.54,35 29.14,34.36 | U$2.33 8.57,35.24 9.21,34.61 9.21,33.94 U$2.35 8.85,33.62 7.94,32.7 v7.94,31.75 | U$3.3 30.52,38.06 v30.8,37.78 | v32.38,39.69 32.38,39.61 | D5.C 12.66,74.05 12.35,74.37 11.02,74.37 10.97,74.32 v10.58,74.32 | D4.C 50.51,62.49 v48.9,62.49 | v38.42,48.26 C11.2 | v14.29,32.7 14.29,32.31 U$2.5 16.44,30.16 v17.14,30.16 | 10.46,29.54 10.79,29.21 v11.11,29.21 | v20,33.02 v23.5,36.51
  Top 0.203: U$3.2 U$3.3
  Top 0.254: 59.37,6.4 59.37,5.08 58.74,4.45 54.93,4.45 53.98,5.4 v53.98,7.62 | 21.67,27.94 C10.2 21.91,28.02 C12.2 22.15,30.24 23.81,28.57 23.81,24.77 v24.13,24.45 | v27.94,20.64 29.79,20.64 30.48,21.32 | U3.2 47.86,31.51 U5.2 50.24,34.84 50.95,34.14 | U6.3 55.24,27.94 54.45,27.15 | C8.2 35.24,45.33 C3.2 C11.2 | U4.2 46.44,20.88 v45.06,22.25 | v42.55,21.59 42.55,22.23 41.91,22.86 40.32,22.86 39.69,23.5 38.95,23.5 R5.1
  Top 0.406: v26.04,15.56 26.99,16.51 30.48,16.51 | U2.2 35.56,16.19 35.24,16.51 30.48,16.51 | 30.48,16.83 30.48,21.32 C2.- 30.61,21.59 v32.07,21.59 | R5.1 38.52,23.5 37.78,23.5 35.75,21.46 C13.- 34.1,21.46 v33.97,21.59 | v33.02,24.13 33.02,26.59 | v50.8,64.13 D4.C | v49.85,73.98 50.58,73.98 50.73,74.12 | D5.C 13.09,74.05 17.14,78.1 v18.1,78.1 | U3.3 | U3.2 U3.3 | v50.48,23.18 U4.2 | U4.3 54.45,27.15 v52.7,25.4 | U5.3 U5.2 | U6.3 | U6.3 50.95,34.14 U6.2 | 30.48,16.51 U1.2
  Bottom 0.152: J3.12 J3.13 | J3.14 20.95,0.79 20.95,6.64 | 20.95,6.64 J3.15 20.95,6.7 20.95,10.8 20.66,11.09 20.66,14.58 J3.16 | J3.6 10.48,12.33 10.48,10.48 7.79,7.79 | 7.79,7.79 J3.12 | J3.12 6.99,7.83 6.99,11.75 7.34,12.11 J3.11 | 7.79,7.79 19.79,7.79 20.95,6.64 | v13.11,25.94 13.11,26.58 12.7,26.99 v9.21,26.99 | v29.71,36.14 28.57,35.01 v28.54,35 | v30.8,37.78 30.8,38.1 v32.38,39.69 39.05,39.69 39.69,40.32 39.69,46.99 v38.42,48.26 38.42,52.02 v48.9,62.49 | J4.6 9.55,74.32 v10.58,74.32 | v14.29,32.7 v15.24,33.66 | v11.11,29.21 8.57,31.75 v7.94,31.75 | v17.14,30.16 17.46,30.48 17.46,30.8 17.78,31.12 17.78,32.07 18.1,32.38 19.68,32.38 20,32.7 v20,33.02 | v23.5,36.51 21.59,38.42 21.59,40.32 21.03,40.89 v21.03,41.52
  Bottom 0.254: 53.31,7.52 53.31,8.6 52.39,9.52 52.39,12.07 51.75,12.7 33.02,12.7 32.7,12.38 29.21,12.38 v26.04,15.56 | 53.31,7.52 J2.GND 53.31,6.38 | v24.13,24.45 v27.94,20.64 | v13.11,25.94 13.11,24.54 12.7,24.13 9.21,24.13 8.57,23.5 8.57,21.91 9.53,20.96 9.53,18.1 7.3,15.88 7.3,14.46 J3.11 | v45.06,22.25 43.2,22.25 v42.55,21.59 | v53.98,7.62 53.41,7.62 53.31,7.52
  Bottom 0.305: J5.15 J5.13 J5.11 J5.9
  Bottom 0.406: v26.04,15.56 21.64,15.56 20.66,14.58 | v33.97,21.59 v32.07,21.59 32.07,23.18 v33.02,24.13 | v50.8,64.13 50.8,67.31 49.53,68.58 49.53,73.66 v49.85,73.98 | v18.1,78.1 19.43,78.1 J1.1 | v50.48,23.18 v52.7,25.4
  pour Top: 0,96.52 0,0 63.5,0 63.5,96.52
  pour Bottom: 0,96.52 0,0 63.5,0 63.5,96.52
MISO  (via drill 0.3)
  Top 0.152: U$2.11 17.77,33.07 v18.68,33.07 20.21,34.61 20.64,34.61 24.77,38.73 v24.77,39.42 | J4.1 2.22,77.47 1.27,76.52 1.27,52.07 v8.89,44.45 | v20.95,44.13 v11.11,44.13
  Bottom 0.152: J3.7 9.34,13.84 9.21,13.97 9.21,16.83 15.24,22.86 15.24,25.72 14.61,26.35 14.61,29.53 16.51,31.43 16.51,32.38 17.2,33.07 v18.68,33.07 | v24.77,39.42 24.77,40.64 23.81,41.59 23.81,43.5 23.18,44.13 v20.95,44.13 | v11.11,44.13 10.79,44.45 v8.89,44.45
MOSI  (via drill 0.3)
  Top 0.152: v18.73,31.75 18.39,31.75 U$2.10 16.19,33.94 16.19,34.29 16.51,34.61 17.46,34.61 17.78,34.29 18.41,34.29 19.37,35.24 19.37,35.88 29.21,45.72 29.21,47.94 29.75,48.48 LCD1.3 29.75,54.07 v29.53,54.29
  Top 0.203: v17.78,60.33 17.78,60.01 v19.07,58.71
  Bottom 0.152: J3.3 13.65,12.45 13.65,13.97 16.83,17.14 | 17.14,17.46 16.83,17.14 | v29.53,54.29 29.53,55.56 26.04,59.05 20.32,59.05 20,58.74 | 16.83,17.14 17.14,17.46 | 17.14,17.46 17.14,28.89 17.74,29.49 17.74,30.31 18.73,31.3 v18.73,31.75
  Bottom 0.203: J4.4 14.29,74.93 14.92,74.29 14.92,63.18 v17.78,60.33 | 20,58.74 19.1,58.74 v19.07,58.71
MPU-INT  (via drill 0.3)
  Top 0.152: 32.13,32.64 32.37,32.41 | 32.13,32.64 v32.07,32.7 | U$2.20 15.24,39.27 15.24,40.32 15.88,40.96 v15.93,40.96 | U7.12 32.37,32.41 | 32.37,32.41 32.13,32.64
  Bottom 0.152: v32.07,32.7 24.45,32.7 16.19,40.96 v15.93,40.96
N$1
  Top 0.152: U7.20 31.86,37.82 C15.1
N$2
  Top 0.152: R4.2 D3.A
N$3
  Top 0.152: U$2.6 16.59,30.76 19.09,30.76 20.08,29.77 C10.1
N$5
  Bottom 0.203: J2.D+ 54.61,7.94 53.66,8.89 R2.2
N$7  (via drill 0.3)
  Top 0.203: U2.5 35.53,18.73 v35.56,18.73 | v38.73,20.96 R5.2
  Bottom 0.203: v35.56,18.73 37.78,20.96 v38.73,20.96
N$8
  Top 0.152: D7.A R10.1
N$9
  Bottom 0.203: J2.D- 55.24,6.16 55.24,7.94 55.56,8.25 R1.2
N$10  (via drill 0.3)
  Top 0.406: R9.1 49.63,77.89 v49.21,77.47 | v49.53,75.88 50.72,75.88 D6.A
  Bottom 0.406: v49.21,77.47 49.21,76.2 v49.53,75.88
N$11
  Top 0.152: U7.10 31.36,28.25 C16.1
N$12  (via drill 0.3, 0.35)
  Top 0.152: U1.3 31.43,14.47 31.1,14.14 29.68,14.14 29.53,13.98
  Top 0.406: v41.91,18.73 41.91,14.29 40.32,12.7 30.48,12.7 29.53,13.65 29.53,13.98 U1.1 | D1.C 40.96,24.13 v40.01,25.08
  Bottom 0.406: S5.3 57.81,55.59 55.88,53.66 55.88,32.07 42.55,18.73 v41.91,18.73 41.91,20.8 40.01,22.7 v40.01,25.08
N$15
  Top 0.152: R3.2 D2.A
N$16
  Top 0.406: R8.1 D5.A
N$17
  Top 0.254: LCD1.8 34.75,48.12 35.24,47.62 C8.1
N$18
  Top 0.406: R7.1 D4.A
N$19
  Top 0.152: Q1.1 17.46,41.17 17.46,38.73 17.14,38.42 16.51,38.42 U$2.17
N$20  (via drill 0.3)
  Top 0.406: v40.96,20.64 D1.A
  Bottom 0.406: 44.13,18.1 43.5,18.1 42.86,17.46 40.96,17.46 40.64,17.78 40.64,20.32 v40.96,20.64
  Bottom 0.508: F1.2 58.42,15.88 56.2,18.1 44.13,18.1
N$21
  Top 0.152: U$2.16 16.9,38.1 18.38,38.1 | 18.38,38.1 18.41,38.1 | Q1.3 18.63,38.1 18.38,38.1
N$22  (via drill 0.3)
  Top 0.152: v16.56,26.04 16.56,25.67 R13.1 | v17.14,31.79 16.93,31.79 U$2.8
  Bottom 0.152: v16.56,26.04 16.51,26.09 16.51,30.48 17.14,31.12 v17.14,31.79
N$23
  Top 0.152: R11.2 D9.C
N$25  (via drill 0.3)
  Top 0.152: R11.1 17.78,24.77 v19.37,23.18 | v17.75,18.52 15.34,18.52 14.29,17.46 4.76,17.46 3.49,18.73 3.49,37.15 9.21,41.91 10.79,41.91 13.02,40.01
  Top 0.203: 13.02,40.01 13.34,39.69 U$2.22
  Bottom 0.152: v19.37,23.18 19.37,20.96 18.73,20.32 18.73,19.5 v17.75,18.52
N$26
  Top 0.152: R13.2 D8.C
RAW  (via drill 0.3)
  Top 0.203: U$2.26 9.99,38.73 v6.35,38.73
  Top 0.406: v45.72,20.64 45.4,20.64 42.03,24.01 42.03,24.96 40.32,26.67 36.2,26.67 35.56,26.04 C13.+ | v45.72,20.64 44.77,19.69 41.27,19.69 40.32,18.73 40.32,15.88 39.69,15.24 36.54,15.24 U2.3 | v45.72,20.64 45.72,13.97 45.09,13.34 v45.09,11.11 | v3.49,38.73 2.86,38.1 2.86,18.41 4.76,16.51 4.76,7.62 8.57,3.49 v14.61,3.49 | v23.81,3.49 v20,3.49
  Bottom 0.203: v6.35,38.73 v3.49,38.73
  Bottom 0.406: S5.2 57.35,52.59 56.83,52.07 56.83,31.75 v45.72,20.64 | v23.81,3.49 24.13,3.81 24.13,7.62 27.62,11.11 v45.09,11.11 | v3.49,38.73 3.49,50.8 7.94,55.24 14.61,55.24 21.95,62.6 J1.2 | v20,3.49 v14.61,3.49
RES  (via drill 0.3)
  Top 0.152: U$2.27 9.93,38.09 v9.52,38.09 | LCD1.9 36.66,50.95 v36.83,51.12 | v13.34,44.77 13.65,44.77 14.29,45.4 v20.64,45.4 | v11.11,42.55 12.06,43.5 v12.7,43.5
  Bottom 0.152: v9.52,38.09 8.89,38.71 8.89,40.64 10.79,42.55 v11.11,42.55 | v36.83,51.12 25.72,51.12 20.64,46.04 v20.64,45.4 | v12.7,43.5 13.34,44.13 v13.34,44.77
RESET  (via drill 0.3)
  Top 0.152: S1.4 S1.3 R12.2 | U$2.13 16.55,35.6 17.78,36.83 19.05,36.83 22.54,40.32 v22.54,40.64 | J4.5 3.49,72.39 2.54,71.44 2.54,55.56 1.91,54.93 1.91,52.07 7.94,46.04 12.7,46.04 v13.02,46.36 | v22.23,43.5 22.23,45.72 21.59,46.36 v14.92,46.36 14.61,46.36
  Top 0.203: R12.2 55.98,14.39 57.78,16.19 57.78,20 54.29,23.5 52.07,23.5 38.42,37.15 v34.61,37.15
  Bottom 0.152: v22.54,40.64 22.23,40.96 v22.23,43.5 | v14.92,46.36 v13.02,46.36
  Bottom 0.203: v34.61,37.15 26.04,37.15 v22.54,40.64
SCE  (via drill 0.3)
  Top 0.152: LCD1.5 31.75,48.9 30.48,47.62 v30.48,45.72 | U$2.31 10.12,35.07 v10.12,34.97 | v13.97,42.86 14.92,43.81 19.68,43.81 20.64,42.86 23.18,42.86 23.81,43.81 v25.4,43.81
  Bottom 0.152: v10.12,34.97 10.16,34.93 11.11,34.93 11.75,35.56 11.75,36.83 13.34,38.42 13.34,41.91 13.97,42.55 v13.97,42.86 | v25.4,43.81 27.3,45.72 v30.48,45.72
SCK  (via drill 0.3)
  Top 0.152: v18.1,35.24 28.75,45.9 LCD1.2 28.75,53.48 v28.57,53.66 | v13.34,28.95 15.03,28.95 v15.19,29.11 | v16.48,58.13 16.51,58.1 v20,58.1 | U$2.9 15.88,33.55 15.88,34.61 15.56,34.93 v15.24,34.93
  Bottom 0.152: v18.1,35.24 15.56,35.24 v15.24,34.93 13.65,33.34 12.7,33.34 11.75,32.38 11.75,30.8 12.7,29.84 12.7,29.58 v13.34,28.95 | J3.5 11.54,13.55 11.43,13.65 11.43,18.62 15.54,22.73 15.54,23.48 15.56,23.5 15.56,27.83 15.19,28.2 v15.19,29.11 | v28.57,53.66 28.57,55.88 25.72,58.74 20.64,58.74 v20,58.1 | J4.3 6.35,73.66 6.35,69.21 6.99,68.58 8.89,68.58 11.43,66.04 11.43,65.09 12.38,64.13 13.34,64.13 16.48,60.98 v16.48,58.13
SCL  (via drill 0.3)
  Top 0.152: U$2.18 14.82,37.37 v16.51,39.05 | v21.91,33.66 23.5,35.56 26.04,35.56 26.25,35.34 R17.2 26.35,34.29 27.94,35.88 27.94,40.32 28.57,40.96 30.16,40.96 30.52,40.6 U$3.4 31.11,40.32 31.43,40.01 31.43,37.47 30.36,36.4 U7.23
  Bottom 0.152: v16.51,39.05 17.14,39.05 21.91,34.29 v21.91,33.66
SDA  (via drill 0.3)
  Top 0.152: 29.75,35.34 29.86,35.22 | 29.75,35.34 29.53,35.56 28.27,35.56 | 28.27,35.56 28.26,35.56 27.94,35.24 27.94,33.02 27.3,32.38 26.27,32.38 | 26.27,32.38 R16.2 | U$3.6 29.17,39.65 28.26,38.73 28.26,35.58 28.27,35.56 | 14.51,37.72 U$2.19 15.56,38.88 15.56,39.4 v16.18,40.02 | v27.3,31.75 26.9,31.75 26.27,32.38 | U7.24 29.86,35.22 | 29.86,35.22 29.75,35.34
  Bottom 0.152: v27.3,31.75 26.67,32.38 24.45,32.38 24.43,32.4 24.32,32.4 16.7,40.02 v16.18,40.02
UVCC  (via drill 0.3)
  Top 0.152: U$2.7 14.68,33.34 13.65,33.34 13.02,32.7 13.02,32.07 13.02,31.93 13.02,31.43 13.66,30.79 U$2.2 13.83,30.65 | 13.83,30.65 13.97,30.51 | R4.1 11.11,20.74 11.11,26.35 12.7,27.94 12.7,29.21 13.02,29.53 13.72,29.53 14.29,30.09 14.29,30.16 13.83,30.62 13.83,30.65
  Top 0.254: U$2.7 15.53,32.48 16.9,31.12 19.68,31.12 20.56,31.99 C12.1 21.98,31.99 28.57,25.72 28.57,23.5 29.21,22.86 32.38,22.86 33.02,22.23 33.02,20.96 34.29,19.69 35.88,19.69 36.51,19.05 36.51,17.83 36.53,17.81
  Top 0.508: v38.73,16.51 37.44,17.81 36.53,17.81 U2.4
  Bottom 0.203: F1.1 58.1,9.71 58.1,8.89 57.15,7.94 56.2,7.94 55.91,7.65 J2.VBUS
  Bottom 0.508: F1.1 56.83,11.62 56.83,13.65 53.98,16.51 v38.73,16.51
VCC  (via drill 0.3)
  Top 0.152: 28.89,29.84 28.26,29.84 26.99,31.12 24.77,31.12 24.45,31.43 | D9.A D8.A 14,19.76 R3.1 13.97,19.05 v13.65,18.73 | R6.1 10.16,26.04 12.06,27.94 12.06,28.43 | 12.06,28.43 U$2.44 | 55.56,16.19 R12.1 v55.56,17.14 | v25.15,14.69 25.15,15.94 26.35,17.14 28.86,17.14 U1.5 | v47.51,12.07 47.51,13.54 47.71,13.54 v51.44,17.27 | U$2.14 15.77,35.56 14.61,35.56 11.74,38.43 U$2.24 11.11,39.02 v10.48,39.69 | v28.89,36.54 29.17,36.82 U$3.1 29.84,39.09 v29.84,39.37 | v23.81,34.93 23.91,34.93 R17.1 | v33.02,29.84 33.02,31.62 33.09,31.69 U7.13 | v30.78,30.11 30.52,29.84 29.84,29.84 | v15.93,28.28 15.9,28.28 15.24,27.62 13.97,27.62 v13.65,27.94 | v11.43,28.26 11.9,28.26 12.06,28.43 | J4.2 6.99,77.47 6.35,76.83 6.35,60.96 J4.16 | v31.75,40.64 v31.75,41.91 | v31.75,43.18 31.96,43.4 R14.2 32.07,44.98 C9.1 32.07,45.33 C14.1 33.66,47.47 32.75,48.37 LCD1.6 32.7,50.99 32.7,54.29 32.07,54.93 28.26,54.93 27.75,54.42 LCD1.1 27.75,52.26 26.99,53.02 v23.81,53.02 | v11.75,56.2 15.88,52.07 18.1,52.07 18.41,52.39 v19.05,52.39 | U$2.42 9.43,29.21 v9.31,29.21 | 6.67,33.02 6.35,32.7 v6.35,31.75 | v7.3,34.61 7.94,33.97 U$2.34 | 30.32,30.32 30.48,30.32 | C1.1 20.32,26.35 21.83,24.84 | 30.32,30.86 30.36,30.91 U7.8 30.36,30.37
  Top 0.203: U$2.34 7.58,33.02 6.67,33.02
  Top 0.254: 28.89,26.99 28.15,26.99 v28.04,27.1 | v27.62,24.77 25.92,24.77 23.91,22.76
  Top 0.305: J5.1 55.88,78.74 53.34,81.28 53.02,81.28 v52.7,80.96 | C11.1 40.08,45.16 40.64,45.72 v40.64,55.24
  Top 0.406: U1.5 28.86,17.81 23.91,22.76 21.83,24.84 21.83,21.22 21.84,21.21 20.39,19.76 D9.A | C2.+ 30.48,25.4 28.89,26.99 28.89,29.84 | 30.36,30.37 30.32,30.32 29.84,29.84 28.26,29.84 28.21,29.84 26.96,31.09 24.79,31.09 24.45,31.43 24.45,32.28 R16.1 R17.1 | R14.2 R15.2 R18.2 R19.2 C11.1 C3.1
  Bottom 0.152: v47.51,12.07 33.66,12.07 33.34,11.75 28.09,11.75 v25.15,14.69 | J3.4 12.63,13.59 12.7,13.65 12.7,18.7 | 12.7,18.7 12.7,19.46 15.88,22.63 15.88,28.23 v15.93,28.28 | v13.65,18.73 12.74,18.73 12.7,18.7 | v28.89,36.54 25.43,36.54 v23.81,34.93 | v33.02,29.84 32.76,30.11 v30.78,30.11 | v51.44,17.27 55.44,17.27 v55.56,17.14 | v13.65,27.94 11.75,27.94 v11.43,28.26 10.27,28.26 v9.31,29.21 8.89,29.21 v6.35,31.75 | v29.84,39.37 31.11,40.64 v31.75,40.64 | v31.75,41.91 v31.75,43.18 | J4.16 11.11,56.2 v11.75,56.2 | v19.05,52.39 19.68,53.02 v23.81,53.02 | v7.3,34.61 7.94,34.61 11.43,38.1 11.43,38.73 v10.48,39.69
  Bottom 0.254: v28.04,27.1 28.04,25.19 v27.62,24.77
  Bottom 0.305: J5.7 J5.5 J5.3 J5.1 | v52.7,80.96 46.99,80.96 45.09,79.06 45.09,63.5 42.55,60.96 42.55,57.15 v40.64,55.24
(copper drawn outside any net)
  shapes: Top area x4580

### Text on the board
tPlace: ISP PROGRAMMING / INTERFACE | A0 | MISO | VCC | A1 | SCK | MOSI | +3.3V | A2 | RST | GND | A3 | D7 | D8 | GND | ~D9 | ~D10 | BACKLIGHT / JUMPER | I/O PINS | NOKIA 5110 / LCD | 8MHZ CRYSTAL | TACTILE / BUTTONS | AMBIENT / LIGHT / SENSOR | GYROSCOPE/ / ACCELEROMETER | USB | PWR | TX | PD5 | ATMEGA32U4 / MICROCONTROLLER | POWER / MANAGEMENT | MCU-RESET
bPlace: BATTERY | POWER SWITCH | Short Jumpers / to use SD Card | MICRO SD / CARD | USB MICRO | #karpeDiem